# EAGLE schematic RasPi-BplusHAT (EAGLE 8.7.0)
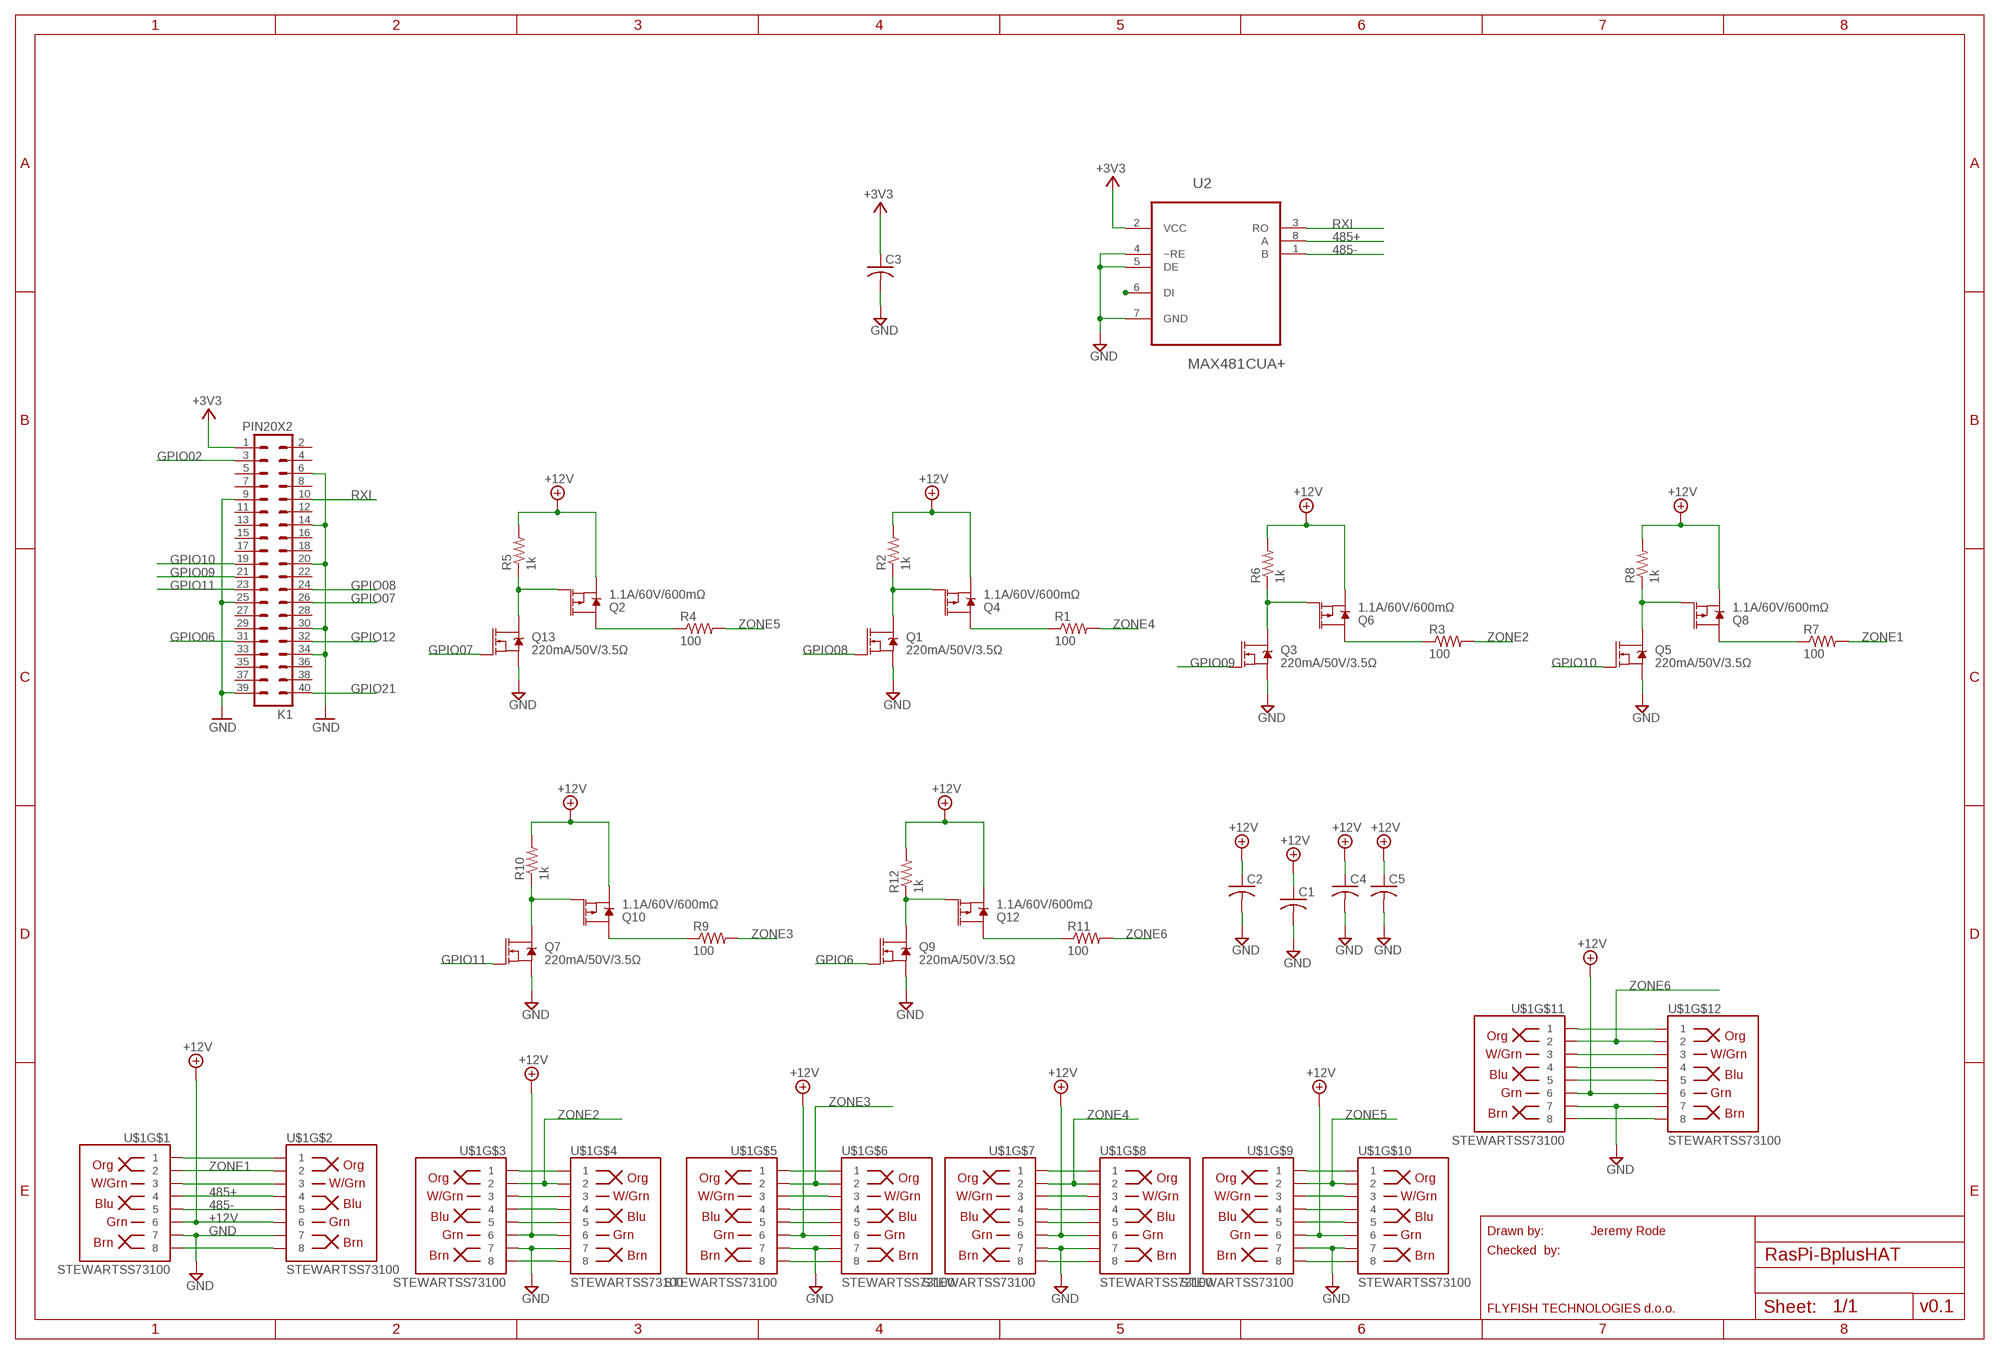
[diagram p0: schematic, sheet 1]

## Parts
C1  C-USC0805  [C0805]
C2  C-USC0805  [C0805]
C3  C-USC0805  [C0805]
C4  C-USC0805  [C0805]
C5  C-USC0805  [C0805]
K1  PIN20X2  [PIN_20X2]
Q1  220mA/50V/3.5Ω  MOSFET-NCH-BSS138  [SOT23-3]
Q2  1.1A/60V/600mΩ  MOSFET_PCH-SI2309DS  [SOT23-3]
Q3  220mA/50V/3.5Ω  MOSFET-NCH-BSS138  [SOT23-3]
Q4  1.1A/60V/600mΩ  MOSFET_PCH-SI2309DS  [SOT23-3]
Q5  220mA/50V/3.5Ω  MOSFET-NCH-BSS138  [SOT23-3]
Q6  1.1A/60V/600mΩ  MOSFET_PCH-SI2309DS  [SOT23-3]
Q7  220mA/50V/3.5Ω  MOSFET-NCH-BSS138  [SOT23-3]
Q8  1.1A/60V/600mΩ  MOSFET_PCH-SI2309DS  [SOT23-3]
Q9  220mA/50V/3.5Ω  MOSFET-NCH-BSS138  [SOT23-3]
Q10  1.1A/60V/600mΩ  MOSFET_PCH-SI2309DS  [SOT23-3]
Q12  1.1A/60V/600mΩ  MOSFET_PCH-SI2309DS  [SOT23-3]
Q13  220mA/50V/3.5Ω  MOSFET-NCH-BSS138  [SOT23-3]
R1  100  R-US_R0805  [R0805]
R2  1k  R-US_R0805  [R0805]
R3  100  R-US_R0805  [R0805]
R4  100  R-US_R0805  [R0805]
R5  1k  R-US_R0805  [R0805]
R6  1k  R-US_R0805  [R0805]
R7  100  R-US_R0805  [R0805]
R8  1k  R-US_R0805  [R0805]
R9  100  R-US_R0805  [R0805]
R10  1k  R-US_R0805  [R0805]
R11  100  R-US_R0805  [R0805]
R12  1k  R-US_R0805  [R0805]
U2  MAX481CUA+  [SOP65P490X110-8N]
U$1  STEWARTSS73100  [STEWARTSS73100]

## Nets
485+: U2.8(A) U$1.P$4 U$1.P$12
485-: U2.1(B) U$1.P$5 U$1.P$13
+3V3: C3.1 K1.1 U2.2(VCC)
+12V: C1.1 C2.1 C4.1 C5.1 Q2.2(S) Q4.2(S) Q6.2(S) Q8.2(S) Q10.2(S) Q12.2(S) R2.2 R5.2 R6.2 R8.2 R10.2 R12.2 U$1.P$6 U$1.P$14 U$1.P$22 U$1.P$30 U$1.P$38 U$1.P$46 U$1.P$54 U$1.P$62 U$1.P$70 U$1.P$78 U$1.P$86 U$1.P$94
GND: C1.2 C2.2 C3.2 C4.2 C5.2 K1.6 K1.9 K1.14 K1.20 K1.25 K1.30 K1.34 K1.39 Q1.2(S) Q3.2(S) Q5.2(S) Q7.2(S) Q9.2(S) Q13.2(S) U2.4(~RE) U2.5(DE) U2.7(GND) U$1.P$7 U$1.P$15 U$1.P$23 U$1.P$31 U$1.P$39 U$1.P$47 U$1.P$55 U$1.P$63 U$1.P$71 U$1.P$79 U$1.P$87 U$1.P$95
GPIO02: K1.3
GPIO6: Q9.1(G)
GPIO06: K1.31
GPIO07: K1.26 Q13.1(G)
GPIO08: K1.24 Q1.1(G)
GPIO09: K1.21 Q3.1(G)
GPIO10: K1.19 Q5.1(G)
GPIO11: K1.23 Q7.1(G)
GPIO12: K1.32
GPIO21: K1.40
N$1: Q1.3(D) Q4.1(G) R2.1
N$2: Q4.3(D) R1.1
N$3: Q3.3(D) Q6.1(G) R6.1
N$4: Q2.1(G) Q13.3(D) R5.1
N$5: Q2.3(D) R4.1
N$6: Q6.3(D) R3.1
N$7: Q5.3(D) Q8.1(G) R8.1
N$8: Q8.3(D) R7.1
N$9: Q7.3(D) Q10.1(G) R10.1
N$10: Q10.3(D) R9.1
N$11: Q9.3(D) Q12.1(G) R12.1
N$12: Q12.3(D) R11.1
N$13: U$1.P$1 U$1.P$9
N$15: U$1.P$3 U$1.P$11
N$17: U2.6(DI)
N$21: U$1.P$17 U$1.P$25
N$23: U$1.P$19 U$1.P$27
N$24: U$1.P$20 U$1.P$28
N$25: U$1.P$21 U$1.P$29
N$29: U$1.P$33 U$1.P$41
N$31: U$1.P$35 U$1.P$43
N$32: U$1.P$36 U$1.P$44
N$33: U$1.P$37 U$1.P$45
N$36: U$1.P$8 U$1.P$16
N$37: U$1.P$49 U$1.P$57
N$39: U$1.P$51 U$1.P$59
N$40: U$1.P$52 U$1.P$60
N$41: U$1.P$53 U$1.P$61
N$45: U$1.P$65 U$1.P$73
N$47: U$1.P$67 U$1.P$75
N$48: U$1.P$68 U$1.P$76
N$49: U$1.P$69 U$1.P$77
N$53: U$1.P$81 U$1.P$89
N$55: U$1.P$83 U$1.P$91
N$56: U$1.P$84 U$1.P$92
N$57: U$1.P$85 U$1.P$93
N$61: U$1.P$24 U$1.P$32
N$62: U$1.P$40 U$1.P$48
N$63: U$1.P$56 U$1.P$64
N$64: U$1.P$72 U$1.P$80
N$65: U$1.P$88 U$1.P$96
RXI: K1.10 U2.3(RO)
ZONE1: R7.2 U$1.P$2 U$1.P$10
ZONE2: R3.2 U$1.P$18 U$1.P$26
ZONE3: R9.2 U$1.P$34 U$1.P$42
ZONE4: R1.2 U$1.P$50 U$1.P$58
ZONE5: R4.2 U$1.P$66 U$1.P$74
ZONE6: R11.2 U$1.P$82 U$1.P$90
Unconnected: K1.2 K1.4 K1.5 K1.7 K1.8 K1.11 K1.12 K1.13 K1.15 K1.16 K1.17 K1.18 K1.22 K1.27 K1.28 K1.29 K1.33 K1.35 K1.36 K1.37 K1.38

## Notes on the sheet
- Drawn by: | Jeremy Rode
- Checked  by:
- FLYFISH TECHNOLOGIES d.o.o. | v0.1

## Library data of the parts
C1-C5 = rcl:C-US: CAPACITOR, American symbol; SPICEPREFIX: C
K1 = FLYFISH:PIN20X2
Q1 Q3 Q5 Q7 Q9 Q13 = SparkFun-DiscreteSemi:MOSFET-NCH: N-channel MOSFETs Voltage controlled devices that allow control of high current outputs. SparkFun Products: SparkFun OpenScale <https://www.sparkfun.com/products/13261> SparkFun Digital Sandbox <https://www.sparkfun.com/products/12651> SparkFun Monster Moto Shield <https://www.sparkfun.com/products/10182> SparkFun MOSFET Power Controller <https://www.sparkfun.com/products/11214>; PROD_ID: TRANS-00830
Q2 Q4 Q6 Q8 Q10 Q12 = SparkFun-DiscreteSemi:MOSFET_PCH: P-channel MOSFETs Voltage controlled devices that allow control of high current outputs. SparkFun Products: SparkFun ESP32 Thing <https://www.sparkfun.com/products/13907> SparkFun ESP8266 Thing <https://www.sparkfun.com/products/13231>; PROD_ID: TRANS-08285
R1-R12 = resistor:R-US_: RESISTOR, American symbol
U2 = MAX481CUA_:MAX481CUA+: Low-Power Slew-Rate-Limited RS-485/RS-422 Transce; AVAILABILITY: Bad; DESCRIPTION: IC TXRX RS485/RS422 5V 8-UMAX; MF: Maxim Integrated; MP: MAX481CUA+; PACKAGE: MSOP-8 Maxim Integrated; PRICE: 1.77 USD
U$1 = Stewart_Connector_SS73100-046F:STEWARTSS73100